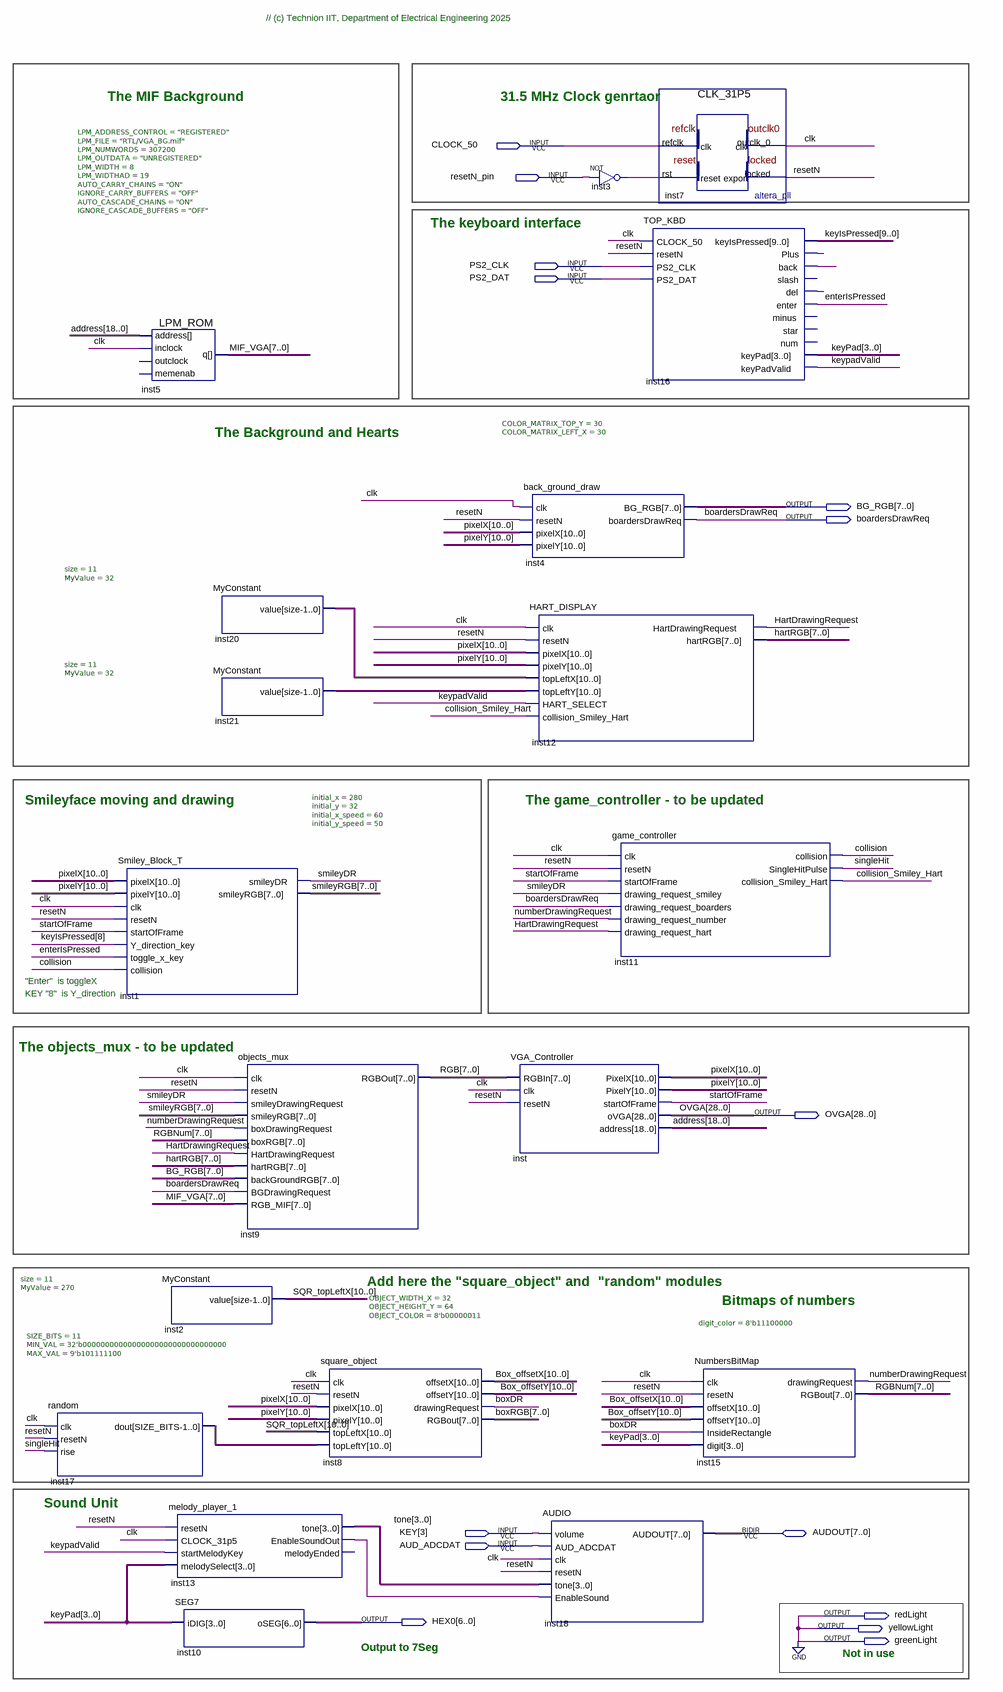
[diagram p0: schematic sheet]
// Quartus schematic TOP_VGA_DEMO_KBD.bdf as structural Verilog: 19 symbols, 14 pins
module TOP_VGA_DEMO_KBD (
  input  CLOCK_50,
  input  resetN_pin,
  input  PS2_CLK,
  input  PS2_DAT,
  input  [3:3] KEY,
  input  AUD_ADCDAT,
  inout  [7:0] AUDOUT,
  output [7:0] BG_RGB,
  output boardersDrawReq,
  output [28:0] OVGA,
  output redLight,
  output [6:0] HEX0,
  output yellowLight,
  output greenLight
);

  wire boxDR, clk, collision, collision_Smiley_Hart, enterIsPressed, HartDrawingRequest, inst3_out,
       inst13_enablesoundout, inst16_back, inst16_del, inst16_plus, keypadValid, numberDrawingRequest,
       resetN, singleHit, smileyDR, startOfFrame;
  wire [3:0] keyPad, tone;
  wire [7:0] boxRGB, hartRGB, MIF_VGA, RGB, RGBNum, smileyRGB;
  wire [9:0] keyIsPressed;
  wire [10:0] Box_offsetX, Box_offsetY, inst17_dout, inst20_value, inst21_value, pixelX, pixelY, SQR_topLeftX;
  wire [18:0] address;

  random #(.SIZE_BITS(11), .MIN_VAL(32'b00000000000000000000000000000000), .MAX_VAL(9'b101111100)) inst17 (
    .clk(clk), .resetN(resetN), .rise(singleHit), .dout(inst17_dout));
  Smiley_Block_T #(.initial_x(280), .initial_y(32), .initial_x_speed(60), .initial_y_speed(50)) inst1 (
    .pixelX(pixelX), .pixelY(pixelY), .clk(clk), .resetN(resetN), .startOfFrame(startOfFrame),
    .Y_direction_key(keyIsPressed[8]), .toggle_x_key(enterIsPressed), .collision(collision),
    .smileyDR(smileyDR), .smileyRGB(smileyRGB));
  LPM_ROM #(.LPM_ADDRESS_CONTROL("REGISTERED"), .LPM_FILE("RTL/VGA_BG.mif"), .LPM_NUMWORDS(307200), .LPM_OUTDATA("UNREGISTERED"), .LPM_WIDTH(8), .LPM_WIDTHAD(19), .AUTO_CARRY_CHAINS("ON"), .IGNORE_CARRY_BUFFERS("OFF"), .AUTO_CASCADE_CHAINS("ON"), .IGNORE_CASCADE_BUFFERS("OFF")) inst5 (
    .address(address), .inclock(clk), .q(MIF_VGA));  // open: outclock, memenab
  MyConstant #(.size(11), .MyValue(270)) inst2 (.value(SQR_topLeftX));
  melody_player_1 inst13 (
    .resetN(resetN), .CLOCK_31p5(clk), .startMelodyKey(keypadValid), .melodySelect(keyPad), .tone(tone),
    .EnableSoundOut(inst13_enablesoundout));  // open: melodyEnded
  SEG7 inst10 (.iDIG(keyPad), .oSEG(HEX0));
  MyConstant #(.size(11), .MyValue(32)) inst20 (.value(inst20_value));
  MyConstant #(.size(11), .MyValue(32)) inst21 (.value(inst21_value));
  objects_mux inst9 (
    .clk(clk), .resetN(resetN), .smileyDrawingRequest(smileyDR), .smileyRGB(smileyRGB),
    .boxDrawingRequest(numberDrawingRequest), .boxRGB(RGBNum), .HartDrawingRequest(HartDrawingRequest),
    .hartRGB(hartRGB), .backGroundRGB(BG_RGB), .BGDrawingRequest(boardersDrawReq), .RGB_MIF(MIF_VGA),
    .RGBOut(RGB));
  square_object #(.OBJECT_WIDTH_X(32), .OBJECT_HEIGHT_Y(64), .OBJECT_COLOR(8'b00000011)) inst8 (
    .clk(clk), .resetN(resetN), .pixelX(pixelX), .pixelY(pixelY), .topLeftX(SQR_topLeftX),
    .topLeftY(inst17_dout), .offsetX(Box_offsetX), .offsetY(Box_offsetY), .drawingRequest(boxDR),
    .RGBout(boxRGB));
  back_ground_draw #(.COLOR_MATRIX_TOP_Y(30), .COLOR_MATRIX_LEFT_X(30)) inst4 (
    .clk(clk), .resetN(resetN), .pixelX(pixelX), .pixelY(pixelY), .BG_RGB(BG_RGB),
    .boardersDrawReq(boardersDrawReq));
  HART_DISPLAY inst12 (
    .clk(clk), .resetN(resetN), .pixelX(pixelX), .pixelY(pixelY), .topLeftX(inst20_value),
    .topLeftY(inst21_value), .HART_SELECT(keypadValid), .collision_Smiley_Hart(collision_Smiley_Hart),
    .HartDrawingRequest(HartDrawingRequest), .hartRGB(hartRGB));
  VGA_Controller inst (
    .RGBIn(RGB), .clk(clk), .resetN(resetN), .PixelX(pixelX), .PixelY(pixelY), .startOfFrame(startOfFrame),
    .oVGA(OVGA), .address(address));
  AUDIO inst18 (
    .volume(KEY[3]), .AUD_ADCDAT(AUD_ADCDAT), .clk(clk), .resetN(resetN), .tone(tone),
    .EnableSound(inst13_enablesoundout), .AUDOUT(AUDOUT));
  not inst3 (inst3_out, resetN_pin);
  TOP_KBD inst16 (
    .CLOCK_50(clk), .resetN(resetN), .PS2_CLK(PS2_CLK), .PS2_DAT(PS2_DAT), .keyIsPressed(keyIsPressed),
    .Plus(inst16_plus), .back(inst16_back), .del(inst16_del), .enter(enterIsPressed), .keyPad(keyPad),
    .keyPadValid(keypadValid));  // open: slash, minus, star, num
  game_controller inst11 (
    .clk(clk), .resetN(resetN), .startOfFrame(startOfFrame), .drawing_request_smiley(smileyDR),
    .drawing_request_boarders(boardersDrawReq), .drawing_request_number(numberDrawingRequest),
    .drawing_request_hart(HartDrawingRequest), .collision(collision), .SingleHitPulse(singleHit),
    .collision_Smiley_Hart(collision_Smiley_Hart));
  CLK_31P5 inst7 (.refclk(CLOCK_50), .rst(inst3_out), .outclk_0(clk), .locked(resetN));
  NumbersBitMap #(.digit_color(8'b11100000)) inst15 (
    .clk(clk), .resetN(resetN), .offsetX(Box_offsetX), .offsetY(Box_offsetY), .InsideRectangle(boxDR),
    .digit(keyPad), .drawingRequest(numberDrawingRequest), .RGBout(RGBNum));

  assign greenLight = 1'b0;
  assign redLight = 1'b0;
  assign yellowLight = 1'b0;

  // Notes on the sheet:
  //   // (c) Technion IIT, Department of Electrical Engineering 2025
  //   The MIF Background
  //   31.5 MHz Clock genrtaor
  //   The keyboard interface
  //   The Background and Hearts
  //   Smileyface moving and drawing
  //   The game_controller - to be updated
  //   "Enter"  is toggleX
  //   KEY "8"  is Y_direction
  //   The objects_mux - to be updated
  //   Add here the "square_object" and  "random" modules
  //   Bitmaps of numbers
  //   Sound Unit
  //   Output to 7Seg
  //   Not in use
endmodule
